# Altium schematic sheet ESP12F.SchDoc
size A4
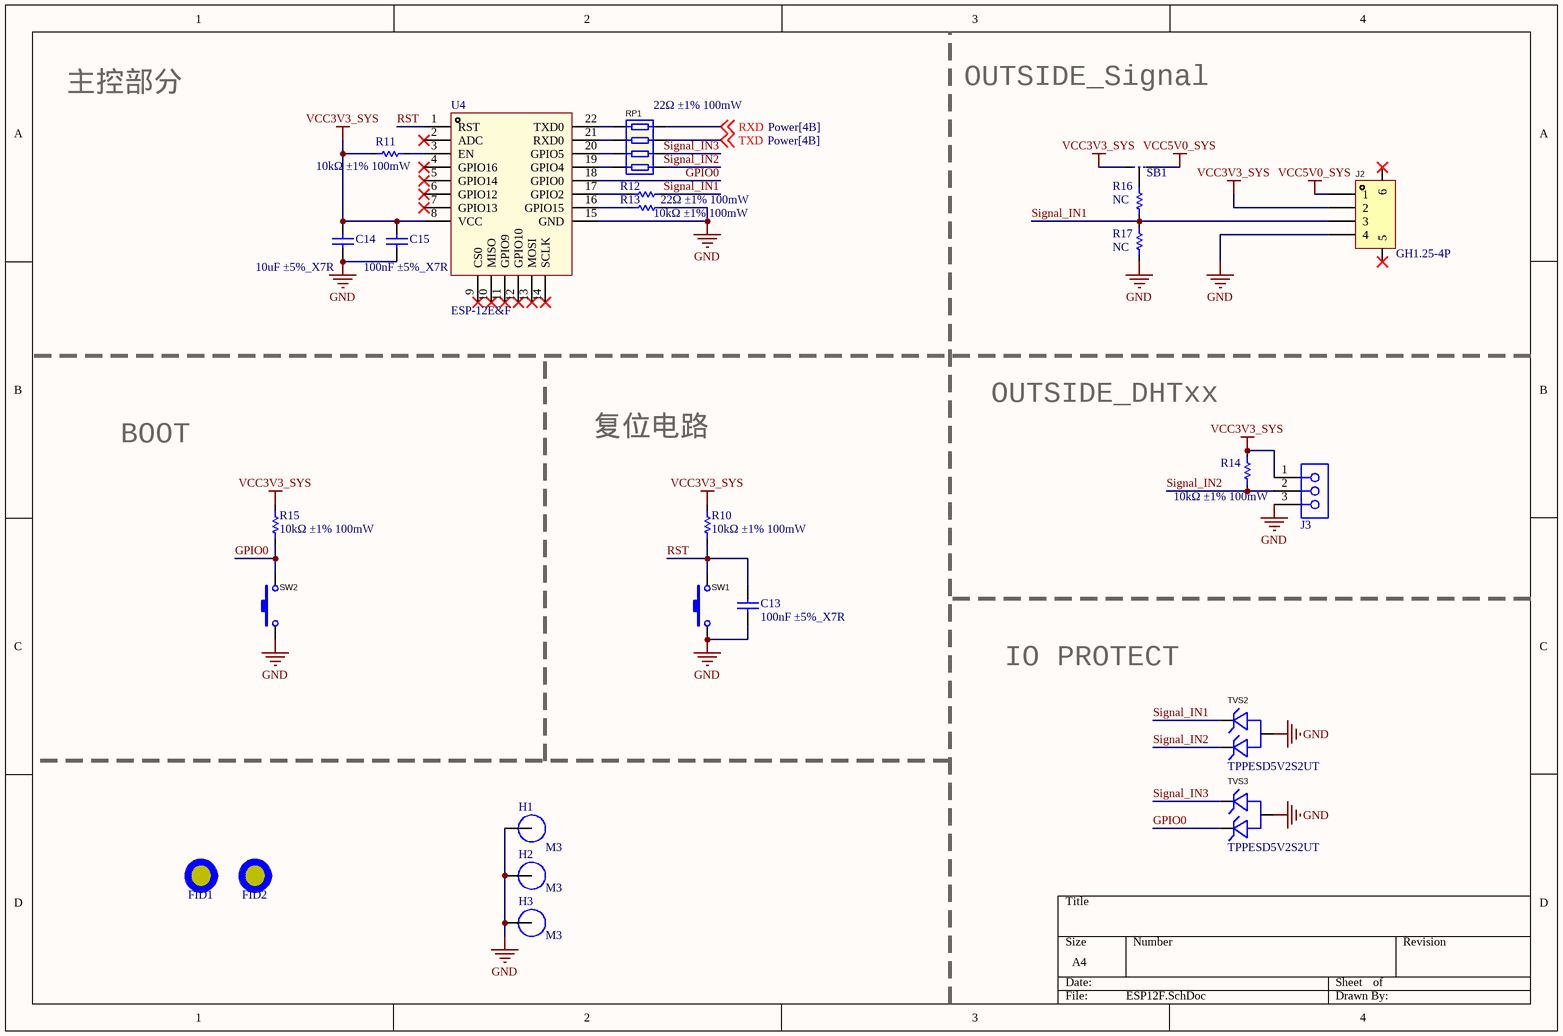
[diagram p0: ESP12F.SchDoc]

## Parts
C13  100nF ±5%_X7R  [C0603]
C14  10uF ±5%_X7R  [C0603]
C15  100nF ±5%_X7R  [C0603]
FID1  MARK Point  [FIDUCIAL]  (value not drawn)
FID2  MARK Point  [FIDUCIAL]  (value not drawn)
H1  M3  [M3_PTH]
H2  M3  [M3_PTH]
H3  M3  [M3_PTH]
J2  GH1.25-4P  [GH1.25-4P]
J3  61300311821  [61300311821]  (value not drawn)
R10  10kΩ ±1% 100mW  [R0402]
R11  10kΩ ±1% 100mW  [R0402]
R12  22Ω ±1% 100mW  [R0402]
R13  10kΩ ±1% 100mW  [R0402]
R14  10kΩ ±1% 100mW  [R0402]
R15  10kΩ ±1% 100mW  [R0402]
R16  NC  [R0402]
R17  NC  [R0402]
RP1  22Ω ±1% 100mW  [RES-ARRAY-SMD_0603-8P-L3.2-W1.6-BL]
SB1  SHORT_3  [SHORT_3_180deg]  (value not drawn)
SW1  TS-1185-B-A-B-A  [SW-SMD_L4.0-W3.0-LS5.0]  (value not drawn)
SW2  TS-1185-B-A-B-A  [SW-SMD_L4.0-W3.0-LS5.0]  (value not drawn)
TVS2  TPPESD5V2S2UT  [SOT-23-3_L2.9-W1.3-P1.90-LS2.4-BR]
TVS3  TPPESD5V2S2UT  [SOT-23-3_L2.9-W1.3-P1.90-LS2.4-BR]
U4  ESP-12E&F  [ESP-12E]

## Nets
GND: C13.1 C14.1 C15.1 H1.1 H2.1 H3.1 J2.4 J3.3 R13.2 R17.1 SW1.1 SW2.1 TVS2.3(K) TVS3.3(K) U4.15(GND)
VCC3V3_SYS: C14.2 C15.2 J2.2 J3.1 R10.2 R11.1 R14.2 R15.2 SB1.1 U4.8(VCC)
VCC5V0_SYS: J2.1 SB1.2
GPIO0: R15.1 SW2.2 TVS3.1(A) U4.18(GPIO0)
RST: C13.2 R10.1 SW1.2 U4.1(RST)
RXD: RP1.4 ; off-sheet RXD
Signal_IN1: J2.3 R12.2 R16.1 R17.2 TVS2.2(A)
Signal_IN2: J3.2 R14.1 RP1.1 TVS2.1(A)
Signal_IN3: RP1.2 TVS3.2(A)
TXD: RP1.3 ; off-sheet TXD
NetR11_2: R11.2 U4.3(EN)
NetR12_1: R12.1 U4.17(GPIO2)
NetR13_1: R13.1 U4.16(GPIO15)
NetR16_2: R16.2 SB1.3
NetRP1_5: RP1.5 U4.22(TXD0)
NetRP1_6: RP1.6 U4.21(RXD0)
NetRP1_7: RP1.7 U4.20(GPIO5)
NetRP1_8: RP1.8 U4.19(GPIO4)

Not connected (* = marked no-connect by the designer): J2 5* 6*; U4 2(ADC)* 4(GPIO16)* 5(GPIO14)* 6(GPIO12)* 7(GPIO13)* 9(CS0)* 10(MISO)* 11(GPIO9)* 12(GPIO10)* 13(MOSI)* 14(SCLK)*

## Notes on the sheet
- 主控部分
- OUTSIDE_Signal
- BOOT
- 复位电路
- OUTSIDE_DHTxx
- IO PROTECT

## Library data of the parts
C13-C15 = Cap: Capacitor; Published: 8-Jun-2000; LatestRevisionDate: 17-Jul-2002; LatestRevisionNote: Re-released for DXP Platform.; PackageReference: RAD-0.3; Publisher: Altium Limited; PackageDescription: Radial Cap, Thru-Hole; 2 Leads; 0.3 in Pin Spacing
FID1 FID2 = FIDUCIAL: 1mm Fiducial with 2mm soldermask, 3mm keepout
H1-H3 = PTH: Hole with copper
J2 = GH1.25-4P: Manufacturer: BOOMELE(博穆精密); Name: GH1.25-5PLTPZ; Add into BOM: yes; Symbol: GH1.25-5PLTPZ; Device: GH1.25-5PLTPZ; LCSC Part Name: GH1.25-5P立贴编带加盖; Supplier Part: C2829263; Manufacturer Part: GH1.25-5PLTPZ; Supplier Footprint: -; JLCPCB Part Class: Extended Part; Datasheet: https://atta.szlcsc.com/upload/public/pdf/source/20211125/08A09A4909F58AF780B71FE423A00F7E.pdf; Supplier: LCSC; Convert to PCB: yes
J3 = 61300311821: WR-PHD Socket Header, THT, Vertical, pitch 2.54mm, 1 Row, 3P; Manufacturer: Wurth Elektronik; Contact Resistance: 20mΩ; Rated Current: 3A; Working Voltage: 250V; Withstanding Voltage: 500V; ComponentLink1Description: Website Link; ComponentLink1URL: https://www.we-online.com/redexpert/article/61300311821?ad; ComponentLink2Description: Datasheet Link; ComponentLink2URL: https://www.we-online.com/redexpert/spec/61300311821?ad; Manufacturer Part Number: 61300311821; Category: Board-to-Board Connectors; Match Code: WR-PHD; Mount: Through Hole; Operating Temperature Max: 125°C; Operating Temperature Min: -40°C; Packaging: Tray; Gender: Socket Header; Number of Pins: 3; Number of Rows: 1; Orientation: Vertical; Pitch: 2.54mm
R10-R17 = Res: Resistor; Published: 8-Jun-2000; LatestRevisionDate: 17-Jul-2002; LatestRevisionNote: Re-released for DXP Platform.; PackageReference: AXIAL-0.3; Publisher: Altium Limited; PackageDescription: Axial Device, Thru-Hole; 2 Leads; 0.3 in Pin Spacing
RP1 = RP: Manufacturer: YAGEO(国巨); Name: 30Ω; Symbol: YC124-JR-0730RL; Add into BOM: yes; Value: 30Ω; Tolerance: ±5%; Power(Watts): 62.5mW; Number of Resistors: 4; Temperature Coefficient: ±200ppm/℃; Device: YC124-JR-0730RL; LCSC Part Name: 30Ω ±5% 0402x4; Supplier Part: C136847; Manufacturer Part: YC124-JR-0730RL; Supplier Footprint: 0402x4; JLCPCB Part Class: Extended Part; Datasheet: https://atta.szlcsc.com/upload/public/pdf/source/20171116/C136847_15108221195481123713.pdf; Supplier: LCSC; Convert to PCB: yes; Number of Pins: 8
SW1 SW2 = Button: 触点电流：50mA 额定电压(DC)：12V 电路结构：单刀单掷 安装方式：立贴 带灯：无 作用力：160gf 机械寿命：10万次 带支架：否 轻触开关3x4x2贴片2脚小龟 160gf; Manufacturer: XKB Connectivity(中国星坤); Add into BOM: yes; Contact Current: 50mA; Voltage Rating (DC): 12V; Circuit: 单刀单掷; Actuator Style: 圆形按钮; Actuator/Cap Color: 黑色; With Lamp: 无; Mechanical Life: 10万次; Switch Length: 4mm; Switch Width: 3mm; Switch Height: 2mm; Strike Gundam: 否; Name: TS-1185-B-A-B-A; Symbol: TS-1185-B-A-B-A; Device: TS-1185-B-A-B-A; LCSC Part Name: 4*3*2mm 立贴 轻触开关; Supplier Part: C561517; Manufacturer Part: TS-1185-B-A-B-A; Supplier Footprint: SMD; JLCPCB Part Class: Extended Part; Datasheet: https://atta.szlcsc.com/upload/public/pdf/source/20211011/C2F26DC0AE1820400F54DBF49644F5A1.pdf; Supplier: LCSC; Convert to PCB: yes; Insulation Resistance: -; Mounting Style: 立贴; Operating Force: 160gf; Operating Temperature: -30℃~+85℃
TVS2 TVS3 = TVS: Manufacturer: TECH PUBLIC(台舟); Add into BOM: yes; Name: TPPESD5V2S2UT; Symbol: TPPESD5V2S2UT; Device: TPPESD5V2S2UT; LCSC Part Name: TPPESD5V2S2UT; Supplier Part: C558449; Manufacturer Part: TPPESD5V2S2UT; Supplier Footprint: SOT-23; JLCPCB Part Class: Extended Part; Datasheet: https://atta.szlcsc.com/upload/public/pdf/source/20210810/D18798CDF2FA9545B0B94BB525A81819.pdf; Supplier: LCSC; Convert to PCB: yes
U4 = ESP-12E&F: ESP-12E&F Onboard Module